# Altium schematic sheet SDRAM.SchDoc
size A4
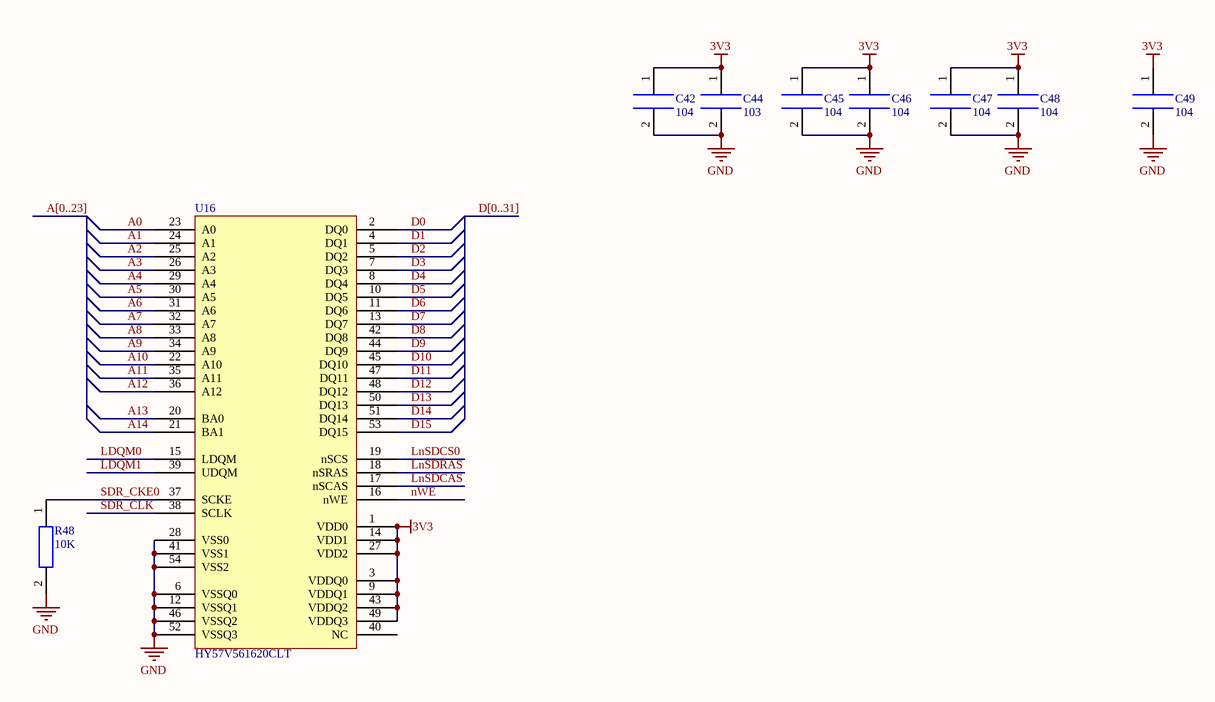
[diagram p0: SDRAM.SchDoc]

## Parts
C42  104  [0603C]
C44  103  [0603C]
C45  104  [0603C]
C46  104  [0603C]
C47  104  [0603C]
C48  104  [0603C]
C49  104  [0603C]
R48  10K  [0603R]
U16  HY57V561620CLT  [TSSOP-54]

## Nets
3V3: C42.1 C44.1 C45.1 C46.1 C47.1 C48.1 C49.1 U16.1(VDD0) U16.3(VDDQ0) U16.9(VDDQ1) U16.14(VDD1) U16.27(VDD2) U16.43(VDDQ2) U16.49(VDDQ3)
GND: C42.2 C44.2 C45.2 C46.2 C47.2 C48.2 C49.2 R48.2 U16.6(VSSQ0) U16.12(VSSQ1) U16.28(VSS0) U16.41(VSS1) U16.46(VSSQ2) U16.52(VSSQ3) U16.54(VSS2)
A0: U16.23(A0)
A1: U16.24(A1)
A2: U16.25(A2)
A3: U16.26(A3)
A4: U16.29(A4)
A5: U16.30(A5)
A6: U16.31(A6)
A7: U16.32(A7)
A8: U16.33(A8)
A9: U16.34(A9)
A10: U16.22(A10)
A11: U16.35(A11)
A12: U16.36(A12)
A13: U16.20(BA0)
A14: U16.21(BA1)
D0: U16.2(DQ0)
D1: U16.4(DQ1)
D2: U16.5(DQ2)
D3: U16.7(DQ3)
D4: U16.8(DQ4)
D5: U16.10(DQ5)
D6: U16.11(DQ6)
D7: U16.13(DQ7)
D8: U16.42(DQ8)
D9: U16.44(DQ9)
D10: U16.45(DQ10)
D11: U16.47(DQ11)
D12: U16.48(DQ12)
D13: U16.50(DQ13)
D14: U16.51(DQ14)
D15: U16.53(DQ15)
LDQM0: U16.15(LDQM)
LDQM1: U16.39(UDQM)
LnSDCAS: U16.17(nSCAS)
LnSDCS0: U16.19(nSCS)
LnSDRAS: U16.18(nSRAS)
nWE: U16.16(nWE)
SDR_CKE0: R48.1 U16.37(SCKE)
SDR_CLK: U16.38(SCLK)

Not connected (* = marked no-connect by the designer): U16 40(NC)

## Buses and harness runs
bus A[0..23]
bus D[0..31]

## Library data of the parts
C42 C44-C49 = CAP
R48 = RES